# Altium schematic sheet SCH_08_InOut_Terminal.SchDoc
size A4; SheetNumber: 13; SheetTotal: 13
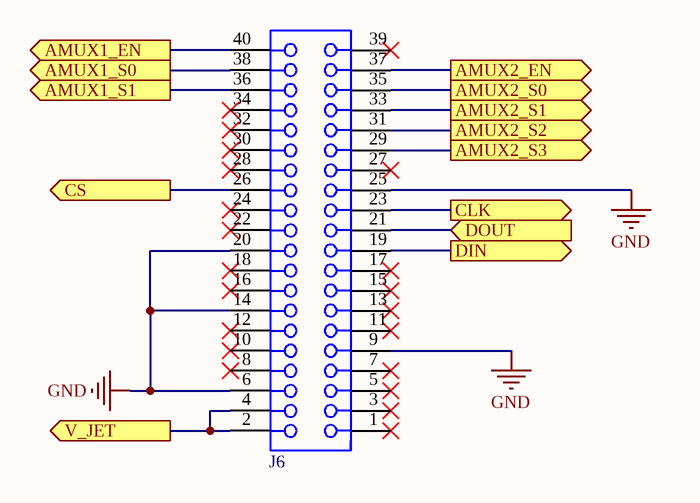
[diagram p0: SCH_08_InOut_Terminal.SchDoc]

## Parts
J6  61304021821  [61304021821]  (value not drawn)

## Ports
AMUX1_EN (out, see Schematic_Top[4B], SCH_05_Analog_Mux[1A]), AMUX1_S0 (out, see Schematic_Top[4B], SCH_05_Analog_Mux[1B]), AMUX1_S1 (out, see Schematic_Top[4C], SCH_05_Analog_Mux[1B]), AMUX2_EN (out, see Schematic_Top[4C], SCH_05_Analog_Mux[1B]), AMUX2_S0 (out, see Schematic_Top[4C], SCH_05_Analog_Mux[1C]), AMUX2_S1 (out, see Schematic_Top[4C], SCH_05_Analog_Mux[1C]), AMUX2_S2 (out, see Schematic_Top[4C], SCH_05_Analog_Mux[1D]), AMUX2_S3 (out, see Schematic_Top[4C], SCH_05_Analog_Mux[1D]), CLK (out, see Schematic_Top[4B], SCH_07_ADC[3C]), CS (out, see Schematic_Top[4B], SCH_07_ADC[3B]), DIN (out, see Schematic_Top[4B], SCH_07_ADC[3C]), DOUT (in, see Schematic_Top[4B], SCH_07_ADC[3C]), V_JET (out, see Schematic_Top[4D], SCH_01_Power[1A])

## Nets
GND: J6.6 J6.9 J6.14 J6.20 J6.25
AMUX1_EN: J6.40 ; port AMUX1_EN
AMUX1_S0: J6.38 ; port AMUX1_S0
AMUX1_S1: J6.36 ; port AMUX1_S1
AMUX2_EN: J6.37 ; port AMUX2_EN
AMUX2_S0: J6.35 ; port AMUX2_S0
AMUX2_S1: J6.33 ; port AMUX2_S1
AMUX2_S2: J6.31 ; port AMUX2_S2
AMUX2_S3: J6.29 ; port AMUX2_S3
CLK: J6.23 ; port CLK
CS: J6.26 ; port CS
DIN: J6.19 ; port DIN
DOUT: J6.21 ; port DOUT
V_JET: J6.2 J6.4 ; port V_JET

Not connected (* = marked no-connect by the designer): J6 1* 3* 5* 7* 8* 10* 11* 12* 13* 15* 16* 17* 18* 22* 24* 27* 28* 30* 32* 34* 39*

## Notes on the sheet
- Title:
- Date:
- Time:
- Drawn by:
- Phung Nhat Minh
- Sheet
- of

## Library data of the parts
J6 = 61304021821: WR-PHD Socket Header, THT, Vertical, pitch 2.54mm, 2 Row, 40P; Manufacturer: Wurth Elektronik; Contact Resistance: 20mOhm; Rated Current: 3A; Working Voltage: 250V; Withstanding Voltage: 500V; Manufacturer Part Number: 61304021821; Category: Board-to-Board Connectors; Match Code: WR-PHD; ComponentLink1Description: Website Link; ComponentLink1URL: https://www.we-online.com/redexpert/article/61304021821?ad; ComponentLink2Description: Datasheet Link; ComponentLink2URL: https://www.we-online.com/redexpert/spec/61304021821?ad; Mount: Through Hole; Operating Temperature Max: 125°C; Operating Temperature Min: -40°C; Packaging: Tray; Gender: Socket Header; Number of Pins: 40; Number of Rows: 2; Orientation: Vertical; Pitch: 2.54mm